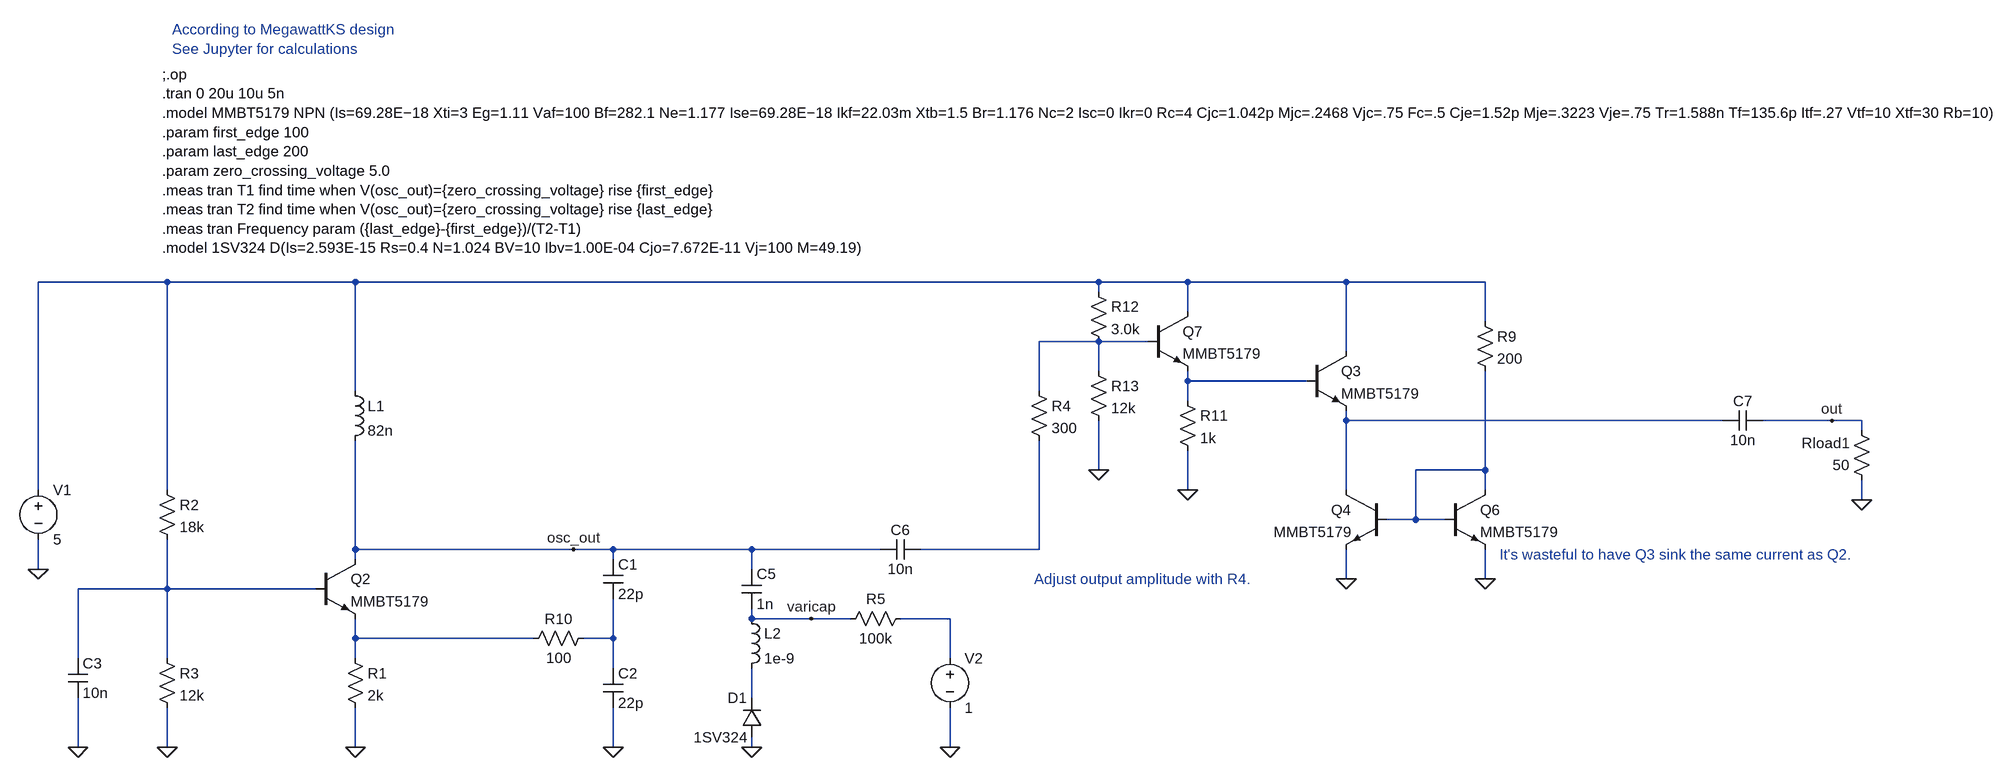
[diagram p0: schematic CB_Colpitts2.asc]
CB_Colpitts2.asc, the LTspice schematic file:
Version 4
SHEET 1 4432 1348
WIRE 48 -192 -160 -192
WIRE 352 -192 48 -192
WIRE 1552 -192 352 -192
WIRE 1696 -192 1552 -192
WIRE 1952 -192 1696 -192
WIRE 2176 -192 1952 -192
WIRE 1552 -176 1552 -192
WIRE 1696 -144 1696 -192
WIRE 2176 -128 2176 -192
WIRE 1552 -96 1456 -96
WIRE 1632 -96 1552 -96
WIRE 1952 -80 1952 -192
WIRE 1552 -48 1552 -96
WIRE 1696 -32 1696 -48
WIRE 1888 -32 1696 -32
WIRE 352 -16 352 -192
WIRE 1456 -16 1456 -96
WIRE 1696 0 1696 -32
WIRE 1952 32 1952 16
WIRE 2560 32 1952 32
WIRE 2736 32 2624 32
WIRE 2784 32 2736 32
WIRE 2784 48 2784 32
WIRE 1552 112 1552 32
WIRE 2176 112 2176 -48
WIRE 2176 112 2064 112
WIRE -160 144 -160 -192
WIRE 48 144 48 -192
WIRE 1696 144 1696 80
WIRE 1952 144 1952 32
WIRE 2176 144 2176 112
WIRE 2784 160 2784 128
WIRE 2064 192 2064 112
WIRE 2064 192 2016 192
WIRE 2112 192 2064 192
WIRE 352 240 352 64
WIRE 704 240 352 240
WIRE 768 240 704 240
WIRE 992 240 768 240
WIRE 1200 240 992 240
WIRE 1456 240 1456 64
WIRE 1456 240 1264 240
WIRE 352 256 352 240
WIRE 768 256 768 240
WIRE -160 272 -160 224
WIRE 992 272 992 240
WIRE 1952 288 1952 240
WIRE 2176 288 2176 240
WIRE 48 304 48 224
WIRE 48 304 -96 304
WIRE 288 304 48 304
WIRE 992 352 992 336
WIRE 1088 352 992 352
WIRE 1152 352 1088 352
WIRE 1312 352 1232 352
WIRE 352 384 352 352
WIRE 640 384 352 384
WIRE 768 384 768 320
WIRE 768 384 720 384
WIRE -96 416 -96 304
WIRE 48 416 48 304
WIRE 352 416 352 384
WIRE 1312 416 1312 352
WIRE 768 432 768 384
WIRE 992 480 992 432
WIRE -96 560 -96 480
WIRE 48 560 48 496
WIRE 352 560 352 496
WIRE 768 560 768 496
WIRE 992 560 992 544
WIRE 1312 560 1312 496
FLAG -160 272 0
FLAG 48 560 0
FLAG 352 560 0
FLAG 768 560 0
FLAG -96 560 0
FLAG 704 240 osc_out
FLAG 1312 560 0
FLAG 992 560 0
FLAG 1088 352 varicap
FLAG 2784 160 0
FLAG 1952 288 0
FLAG 2736 32 out
FLAG 2176 288 0
FLAG 1696 144 0
FLAG 1552 112 0
DATAFLAG 144 304 ""
DATAFLAG 880 240 ""
DATAFLAG 464 384 ""
DATAFLAG 1360 240 ""
DATAFLAG 2064 32 ""
DATAFLAG 1808 -32 ""
DATAFLAG 2176 0 ""
SYMBOL npn 288 256 R0
SYMATTR InstName Q2
SYMATTR Value MMBT5179
SYMBOL res 336 400 R0
SYMATTR InstName R1
SYMATTR Value 2k
SYMBOL res 32 128 R0
SYMATTR InstName R2
SYMATTR Value 18k
SYMBOL res 32 400 R0
SYMATTR InstName R3
SYMATTR Value 12k
SYMBOL voltage -160 128 R0
SYMATTR InstName V1
SYMATTR Value 5
SYMBOL ind 336 -32 R0
SYMATTR InstName L1
SYMATTR Value 82n
SYMATTR SpiceLine Rser=0.01
SYMBOL cap 752 256 R0
SYMATTR InstName C1
SYMATTR Value 22p
SYMBOL cap 752 432 R0
SYMATTR InstName C2
SYMATTR Value 22p
SYMBOL cap -112 416 R0
SYMATTR InstName C3
SYMATTR Value 10n
SYMBOL res 1248 336 R90
WINDOW 0 0 56 VBottom 2
WINDOW 3 32 56 VTop 2
SYMATTR InstName R5
SYMATTR Value 100k
SYMBOL voltage 1312 400 R0
SYMATTR InstName V2
SYMATTR Value 1
SYMBOL diode 1008 544 R180
WINDOW 0 24 64 Left 2
WINDOW 3 24 0 Left 2
SYMATTR InstName D1
SYMATTR Value 1SV324
SYMBOL ind 976 336 R0
SYMATTR InstName L2
SYMATTR Value 1e-9
SYMBOL cap 1264 224 R90
WINDOW 0 0 32 VBottom 2
WINDOW 3 32 32 VTop 2
SYMATTR InstName C6
SYMATTR Value 10n
SYMBOL res 736 368 R90
WINDOW 0 0 56 VBottom 2
WINDOW 3 32 56 VTop 2
SYMATTR InstName R10
SYMATTR Value 100
SYMBOL cap 976 272 R0
SYMATTR InstName C5
SYMATTR Value 1n
SYMBOL npn 1888 -80 R0
SYMATTR InstName Q3
SYMATTR Value MMBT5179
SYMBOL res 2800 144 R180
WINDOW 0 36 76 Left 2
WINDOW 3 36 40 Left 2
SYMATTR InstName Rload1
SYMATTR Value 50
SYMBOL cap 2624 16 R90
WINDOW 0 0 32 VBottom 2
WINDOW 3 32 32 VTop 2
SYMATTR InstName C7
SYMATTR Value 10n
SYMBOL npn 2016 144 M0
SYMATTR InstName Q4
SYMATTR Value MMBT5179
SYMBOL npn 2112 144 R0
SYMATTR InstName Q6
SYMATTR Value MMBT5179
SYMBOL res 2160 -144 R0
SYMATTR InstName R9
SYMATTR Value 200
SYMBOL npn 1632 -144 R0
SYMATTR InstName Q7
SYMATTR Value MMBT5179
SYMBOL res 1680 -16 R0
SYMATTR InstName R11
SYMATTR Value 1k
SYMBOL res 1536 -192 R0
SYMATTR InstName R12
SYMATTR Value 3.0k
SYMBOL res 1536 -64 R0
SYMATTR InstName R13
SYMATTR Value 12k
SYMBOL res 1440 -32 R0
SYMATTR InstName R4
SYMATTR Value 300
TEXT 40 -528 Left 2 !;.op\n.tran 0 20u 10u 5n\n.model MMBT5179 NPN (Is=69.28E−18 Xti=3 Eg=1.11 Vaf=100 Bf=282.1 Ne=1.177 Ise=69.28E−18 Ikf=22.03m Xtb=1.5 Br=1.176 Nc=2 Isc=0 Ikr=0 Rc=4 Cjc=1.042p Mjc=.2468 Vjc=.75 Fc=.5 Cje=1.52p Mje=.3223 Vje=.75 Tr=1.588n Tf=135.6p Itf=.27 Vtf=10 Xtf=30 Rb=10)\n.param first_edge 100\n.param last_edge 200\n.param zero_crossing_voltage 5.0\n.meas tran T1 find time when V(osc_out)={zero_crossing_voltage} rise {first_edge}\n.meas tran T2 find time when V(osc_out)={zero_crossing_voltage} rise {last_edge}\n.meas tran Frequency param ({last_edge}-{first_edge})/(T2-T1)\n.model 1SV324 D(Is=2.593E-15 Rs=0.4 N=1.024 BV=10 Ibv=1.00E-04 Cjo=7.672E-11 Vj=100 M=49.19)
TEXT 56 -600 Left 2 ;According to MegawattKS design\nSee Jupyter for calculations
TEXT 2200 248 Left 2 ;It's wasteful to have Q3 sink the same current as Q2.
TEXT 1448 288 Left 2 ;Adjust output amplitude with R4.

The netlist it stands for:
* CB_Colpitts2.asc
Q2 osc_out N007 N009 0 MMBT5179
R1 N009 0 2k
R2 N001 N007 18k
R3 N007 0 12k
V1 N001 0 5
L1 N001 osc_out 82n Rser=0.01
C1 osc_out N010 22p
C2 N010 0 22p
C3 N007 0 10n
R5 N008 varicap 100k
V2 N008 0 1
D1 0 N011 1SV324
L2 varicap N011 1e-9
C6 N006 osc_out 10n
R10 N010 N009 100
C5 osc_out varicap 1n
Q3 N001 N003 N004 0 MMBT5179
Rload1 0 out 50
C7 out N004 10n
Q4 N004 N005 0 0 MMBT5179
Q6 N005 N005 0 0 MMBT5179
R9 N001 N005 200
Q7 N001 N002 N003 0 MMBT5179
R11 N003 0 1k
R12 N001 N002 3.0k
R13 N002 0 12k
R4 N002 N006 300
.model D D
.lib standard.dio
.model NPN NPN
.model PNP PNP
.lib standard.bjt
;.op
.tran 0 20u 10u 5n
.model MMBT5179 NPN (Is=69.28E−18 Xti=3 Eg=1.11 Vaf=100 Bf=282.1 Ne=1.177 Ise=69.28E−18 Ikf=22.03m Xtb=1.5 Br=1.176 Nc=2 Isc=0 Ikr=0 Rc=4 Cjc=1.042p Mjc=.2468 Vjc=.75 Fc=.5 Cje=1.52p Mje=.3223 Vje=.75 Tr=1.588n Tf=135.6p Itf=.27 Vtf=10 Xtf=30 Rb=10)
.param first_edge 100
.param last_edge 200
.param zero_crossing_voltage 5.0
.meas tran T1 find time when V(osc_out)={zero_crossing_voltage} rise {first_edge}
.meas tran T2 find time when V(osc_out)={zero_crossing_voltage} rise {last_edge}
.meas tran Frequency param ({last_edge}-{first_edge})/(T2-T1)
.model 1SV324 D(Is=2.593E-15 Rs=0.4 N=1.024 BV=10 Ibv=1.00E-04 Cjo=7.672E-11 Vj=100 M=49.19)
* According to MegawattKS design
* See Jupyter for calculations
* It's wasteful to have Q3 sink the same current as Q2.
* Adjust output amplitude with R4.
.backanno
.end